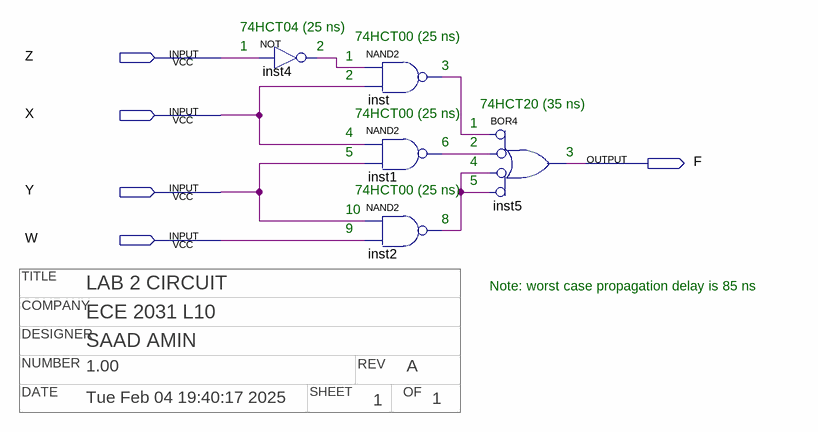
[diagram p0: schematic sheet]
// Quartus schematic CircuitPlan.bdf as structural Verilog: 5 symbols, 5 pins
// Title block: COMPANY: ECE 2031 L10; DATE: Tue Feb 04 19:40:17 2025; DESIGNER: SAAD AMIN; NUMBER: 1.00; OF: 1; REV: A; SHEET: 1; TITLE: LAB 2 CIRCUIT
module CircuitPlan (
  input  Z,
  input  X,
  input  Y,
  input  W,
  output F
);

  wire inst1_out, inst2_out, inst4_out, inst_out;

  not inst4 (inst4_out, Z);
  nand inst (inst_out, inst4_out, X);
  nand inst1 (inst1_out, X, Y);
  nand inst2 (inst2_out, Y, W);
  or inst5 (F, ~inst_out, ~inst1_out, ~inst2_out, ~inst2_out);  // BOR4

  // Notes on the sheet:
  //   74HCT04 (25 ns)
  //   74HCT00 (25 ns)
  //   1
  //   2
  //   1
  //   3
  //   2
  //   74HCT20 (35 ns)
  //   74HCT00 (25 ns)
  //   1
  //   4
  //   6
  //   2
  //   5
  //   3
  //   4
  //   5
  //   74HCT00 (25 ns)
  //   10
  //   8
  //   9
  //   Note: worst case propagation delay is 85 ns
endmodule
